# EAGLE schematic untitled2 (EAGLE 6.3)
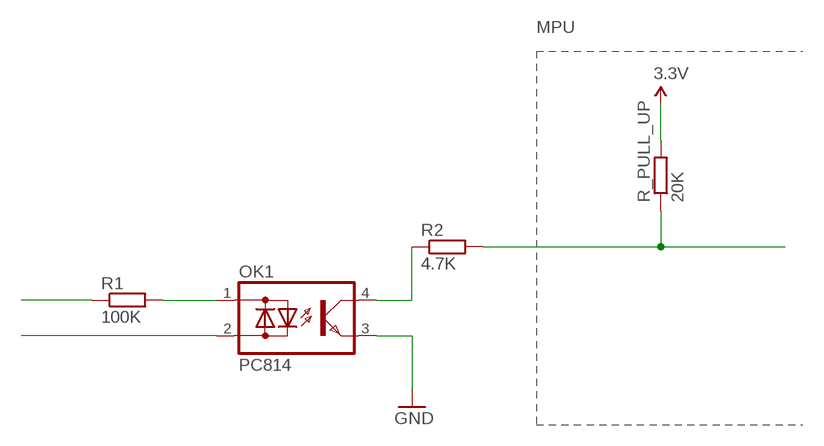
[diagram p0: schematic, sheet 1]

## Parts
OK1  PC814  [DIL04]
R1  100K  R-EU_0204/2V  [0204V]
R2  4.7K  R-EU_0204/2V  [0204V]
R_PULL_UP  20K  R-EU_0204/2V  [0204V]

## Nets
3.3V: R_PULL_UP.2
GND: OK1.3(E)
N$1: OK1.1(AC1) R1.2
N$2: OK1.2(AC2)
N$3: R1.1
N$4: R2.2 R_PULL_UP.1
N$5: OK1.4(C) R2.1

## Notes on the sheet
- MPU

## Library data of the parts
OK1 = optocoupler:PC814: SHARP OPTO COUPLER; OC_FARNELL: 9707662; OC_NEWARK: unknown
R1 R2 R_PULL_UP = rcl:R-EU_: RESISTOR, European symbol